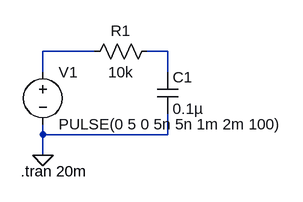
[diagram p0: schematic RC_Demo.asc]
RC_Demo.asc, the LTspice schematic file:
Version 4
SHEET 1 880 680
WIRE 128 80 48 80
WIRE 240 80 208 80
WIRE 48 112 48 80
WIRE 240 112 240 80
WIRE 48 208 48 192
WIRE 240 208 240 176
WIRE 240 208 48 208
WIRE 48 240 48 208
FLAG 48 240 0
SYMBOL voltage 48 96 R0
WINDOW 123 0 0 Left 2
WINDOW 39 0 0 Left 2
SYMATTR InstName V1
SYMATTR Value PULSE(0 5 0 5n 5n 1m 2m 100)
SYMBOL res 112 96 R270
WINDOW 0 32 56 VTop 2
WINDOW 3 0 56 VBottom 2
SYMATTR InstName R1
SYMATTR Value 10k
SYMBOL cap 224 112 R0
SYMATTR InstName C1
SYMATTR Value 0.1µ
TEXT 14 264 Left 2 !.tran 20m

The netlist it stands for:
* RC_Demo.asc
V1 N001 0 PULSE(0 5 0 5n 5n 1m 2m 100)
R1 N001 N002 10k
C1 N002 0 0.1µ
.tran 20m
.backanno
.end